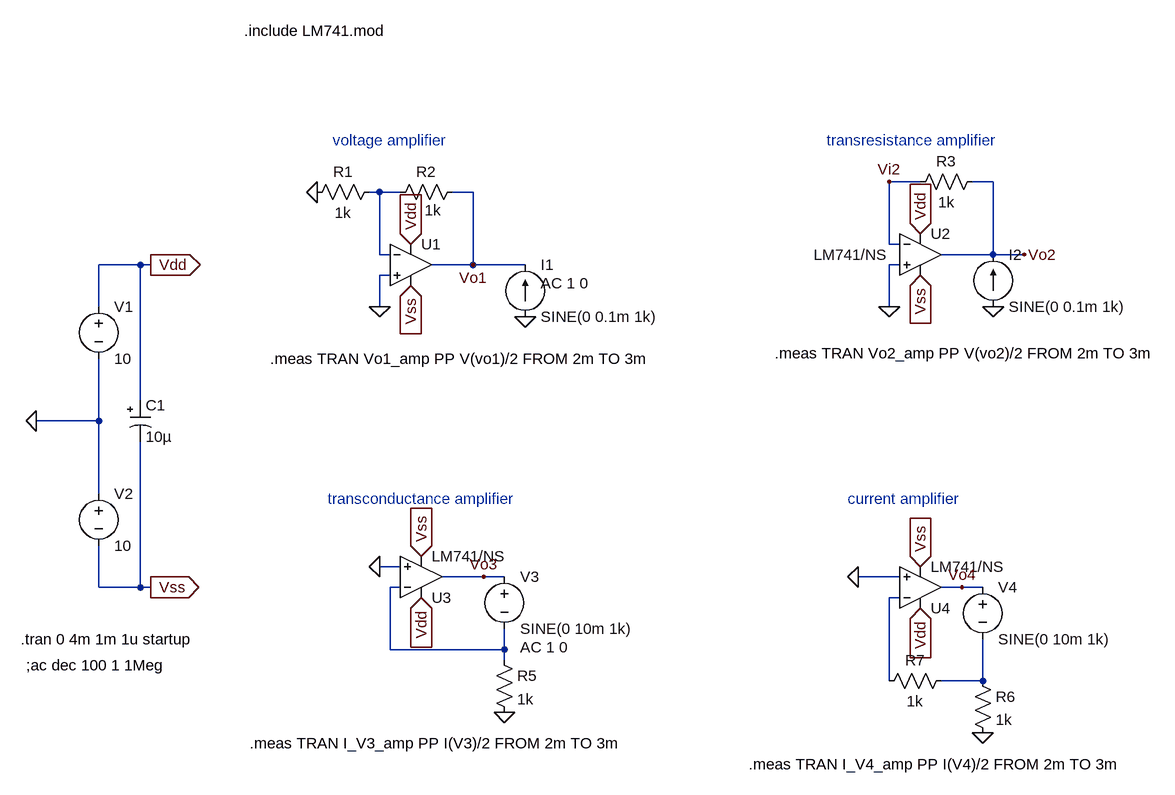
[diagram p0: schematic amplifiers_output_impedance.asc]
amplifiers_output_impedance.asc, the LTspice schematic file:
Version 4
SHEET 1 1200 680
WIRE 816 -384 768 -384
WIRE 928 -384 896 -384
WIRE -16 -368 -32 -368
WIRE 16 -368 -16 -368
WIRE 128 -368 96 -368
WIRE 768 -288 768 -384
WIRE 784 -288 768 -288
WIRE -16 -272 -16 -368
WIRE 0 -272 -16 -272
WIRE 928 -272 928 -384
WIRE 928 -272 848 -272
WIRE 976 -272 928 -272
WIRE -384 -256 -448 -256
WIRE -368 -256 -384 -256
WIRE 128 -256 128 -368
WIRE 128 -256 64 -256
WIRE 208 -256 128 -256
WIRE 784 -256 768 -256
WIRE 0 -240 -16 -240
WIRE -448 -192 -448 -256
WIRE -16 -192 -16 -240
WIRE 768 -192 768 -256
WIRE -384 -48 -384 -256
WIRE -448 -16 -448 -112
WIRE -448 -16 -544 -16
WIRE -448 96 -448 -16
WIRE 16 208 -16 208
WIRE 144 224 80 224
WIRE 176 224 144 224
WIRE 784 224 720 224
WIRE -448 240 -448 176
WIRE -384 240 -384 16
WIRE -384 240 -448 240
WIRE -368 240 -384 240
WIRE 16 240 0 240
WIRE 880 240 848 240
WIRE 912 240 880 240
WIRE 784 256 768 256
WIRE 0 336 0 240
WIRE 176 336 176 304
WIRE 176 336 0 336
WIRE 176 352 176 336
WIRE 768 384 768 256
WIRE 912 384 912 320
WIRE 912 384 848 384
FLAG -368 -256 Vdd
IOPIN -368 -256 Out
FLAG -368 240 Vss
IOPIN -368 240 Out
FLAG -544 -16 0
FLAG 32 -288 Vdd
IOPIN 32 -288 In
FLAG 816 -304 Vdd
IOPIN 816 -304 In
FLAG 48 256 Vdd
IOPIN 48 256 In
FLAG 816 272 Vdd
IOPIN 816 272 In
FLAG 32 -224 Vss
IOPIN 32 -224 In
FLAG 48 192 Vss
IOPIN 48 192 In
FLAG 816 208 Vss
IOPIN 816 208 In
FLAG 816 -240 Vss
IOPIN 816 -240 In
FLAG 208 -176 0
FLAG -112 -368 0
FLAG 128 -256 Vo1
FLAG 176 432 0
FLAG 768 -192 0
FLAG 720 224 0
FLAG 912 464 0
FLAG 976 -272 Vo2
FLAG 880 240 Vo4
FLAG 144 224 Vo3
FLAG 768 -384 Vi2
FLAG -16 -192 0
FLAG 928 -192 0
FLAG -16 208 0
SYMBOL voltage -448 -208 R0
WINDOW 123 0 0 Left 0
WINDOW 39 0 0 Left 0
SYMATTR InstName V1
SYMATTR Value 10
SYMBOL voltage -448 80 R0
WINDOW 123 0 0 Left 0
WINDOW 39 0 0 Left 0
SYMATTR InstName V2
SYMATTR Value 10
SYMBOL res -16 -384 R90
WINDOW 0 0 56 VBottom 2
WINDOW 3 32 56 VTop 2
SYMATTR InstName R1
SYMATTR Value 1k
SYMBOL res 112 -384 R90
WINDOW 0 0 56 VBottom 2
WINDOW 3 28 46 VTop 2
SYMATTR InstName R2
SYMATTR Value 1k
SYMBOL res 160 336 R0
SYMATTR InstName R5
SYMATTR Value 1k
SYMBOL res 912 -400 R90
WINDOW 0 0 56 VBottom 2
WINDOW 3 32 56 VTop 2
SYMATTR InstName R3
SYMATTR Value 1k
SYMBOL res 896 368 R0
SYMATTR InstName R6
SYMATTR Value 1k
SYMBOL res 864 368 R90
WINDOW 0 0 56 VBottom 2
WINDOW 3 32 56 VTop 2
SYMATTR InstName R7
SYMATTR Value 1k
SYMBOL OpAmps\\opamp2 816 -336 R0
WINDOW 3 -164 64 Left 2
SYMATTR Value LM741/NS
SYMATTR InstName U2
SYMBOL OpAmps\\opamp2 32 -320 R0
WINDOW 3 -161 63 Invisible 2
SYMATTR Value LM741/NS
SYMATTR InstName U1
SYMBOL OpAmps\\opamp2 48 288 M180
SYMATTR InstName U3
SYMATTR Value LM741/NS
SYMBOL OpAmps\\opamp2 816 304 M180
SYMATTR InstName U4
SYMATTR Value LM741/NS
SYMBOL current 208 -176 M180
WINDOW 0 24 80 Left 2
WINDOW 3 24 0 Left 2
WINDOW 123 24 52 Left 2
WINDOW 39 0 0 Left 0
SYMATTR InstName I1
SYMATTR Value SINE(0 0.1m 1k)
SYMATTR Value2 AC 1 0
SYMBOL polcap -400 -48 R0
WINDOW 3 24 56 Left 2
SYMATTR Value 10µ
SYMATTR InstName C1
SYMATTR Description Capacitor
SYMATTR Type cap
SYMATTR SpiceLine V=6.3 Irms=0 Rser=4 Lser=0 mfg="AVX" pn="TAJA106M006" type="Tantalum"
SYMBOL current 928 -192 M180
WINDOW 0 24 80 Left 2
WINDOW 3 24 0 Left 2
WINDOW 123 0 0 Left 0
WINDOW 39 0 0 Left 0
SYMATTR InstName I2
SYMATTR Value SINE(0 0.1m 1k)
SYMBOL voltage 176 208 R0
WINDOW 123 24 124 Left 2
WINDOW 39 0 0 Left 0
SYMATTR Value2 AC 1 0
SYMATTR InstName V3
SYMATTR Value SINE(0 10m 1k)
SYMBOL voltage 912 224 R0
WINDOW 123 0 0 Left 0
WINDOW 39 0 0 Left 0
SYMATTR InstName V4
SYMATTR Value SINE(0 10m 1k)
TEXT -88 -448 Left 2 ;voltage amplifier
TEXT 704 104 Left 2 ;current amplifier
TEXT -96 104 Left 2 ;transconductance amplifier
TEXT 672 -448 Left 2 ;transresistance amplifier
TEXT -568 320 Left 2 !.tran 0 4m 1m 1u startup
TEXT -224 -616 Left 2 !.include LM741.mod
TEXT -184 -112 Left 2 !.meas TRAN Vo1_amp PP V(vo1)/2 FROM 2m TO 3m
TEXT 592 -120 Left 2 !.meas TRAN Vo2_amp PP V(vo2)/2 FROM 2m TO 3m
TEXT -216 480 Left 2 !.meas TRAN I_V3_amp PP I(V3)/2 FROM 2m TO 3m
TEXT 552 512 Left 2 !.meas TRAN I_V4_amp PP I(V4)/2 FROM 2m TO 3m
TEXT -560 360 Left 2 !;ac dec 100 1 1Meg

The netlist it stands for:
* amplifiers_output_impedance.asc
V1 Vdd 0 10
V2 0 Vss 10
R1 N001 0 1k
R2 Vo1 N001 1k
R5 N002 0 1k
R3 Vo2 Vi2 1k
R6 N004 0 1k
R7 N004 N003 1k
XU2 0 Vi2 Vdd Vss Vo2 LM741/NS  ; pins In+ In- V+ V- OUT
XU1 0 N001 Vdd Vss Vo1 LM741/NS  ; pins In+ In- V+ V- OUT
XU3 0 N002 Vdd Vss Vo3 LM741/NS  ; pins In+ In- V+ V- OUT
XU4 0 N003 Vdd Vss Vo4 LM741/NS  ; pins In+ In- V+ V- OUT
I1 0 Vo1 SINE(0 0.1m 1k) AC 1 0
C1 Vdd Vss 10µ V=6.3 Irms=0 Rser=4 Lser=0 mfg="AVX" pn="TAJA106M006" type="Tantalum"
I2 0 Vo2 SINE(0 0.1m 1k)
V3 Vo3 N002 SINE(0 10m 1k) AC 1 0
V4 Vo4 N004 SINE(0 10m 1k)
* voltage amplifier
* current amplifier
* transconductance amplifier
* transresistance amplifier
.tran 0 4m 1m 1u startup
.include LM741.mod
.meas TRAN Vo1_amp PP V(vo1)/2 FROM 2m TO 3m
.meas TRAN Vo2_amp PP V(vo2)/2 FROM 2m TO 3m
.meas TRAN I_V3_amp PP I(V3)/2 FROM 2m TO 3m
.meas TRAN I_V4_amp PP I(V4)/2 FROM 2m TO 3m
;ac dec 100 1 1Meg
.backanno
.end